# EAGLE schematic Wideband AFR (EAGLE 9.6.2)
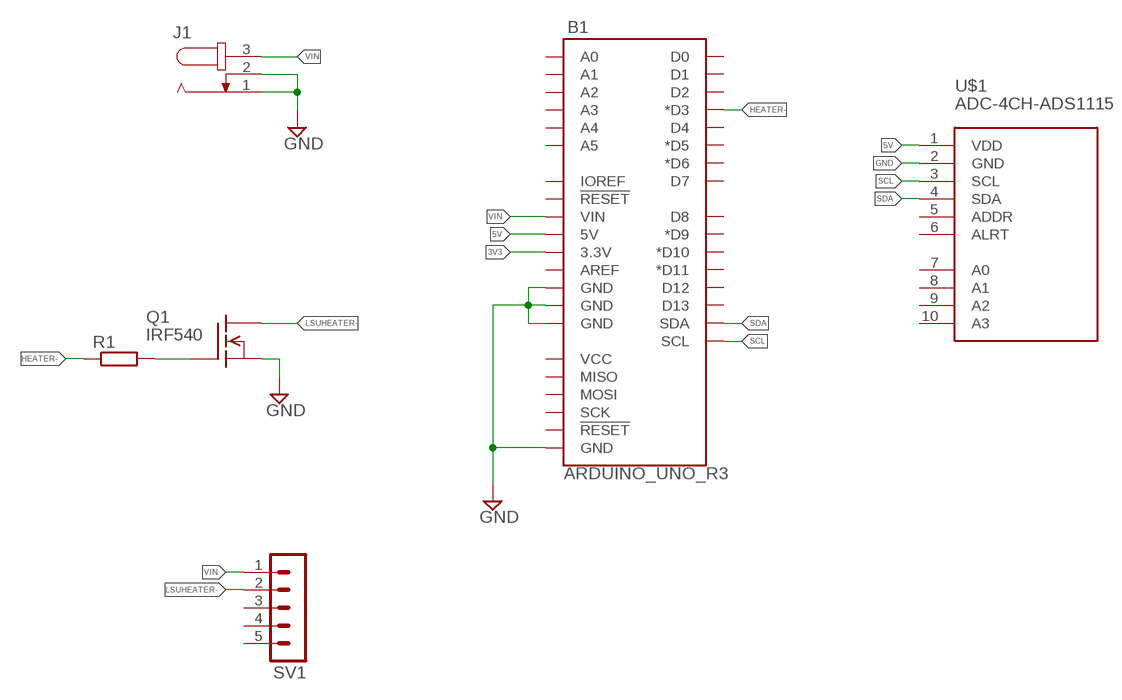
[diagram p0: schematic, sheet 1]

## Parts
B1  ARDUINO_UNO_R3  [ARDUINO_R3]
J1  JACK-PLUG1  [SPC4078]
Q1  IRF540  [TO220]
R1  R-EU_0207/10  [0207/10]
SV1  MA05-1  [MA05-1]
U$1  ADC-4CH-ADS1115  [ADC-4CH-ADS1115]

## Nets
3V3: B1.3.3V
5V: B1.5V U$1.1(VDD)
GND: B1.GND@1(GND) B1.GND@2(GND) B1.GND@3(GND) B1.GND@4(GND) Q1.3(S) U$1.2(GND)
HEATER-: B1.D3(*D3) R1.1
LSUHEATER-: Q1.2(D) SV1.2
N$1: J1.1 J1.2 ; supply symbol labelled GND
N$2: Q1.1(G) R1.2
SCL: B1.SCL U$1.3(SCL)
SDA: B1.SDA U$1.4(SDA)
VIN: B1.VIN J1.3 SV1.1
Unconnected: B1.A0 B1.A1 B1.A2 B1.A3 B1.A4 B1.A5 B1.AREF B1.D0 B1.D1 B1.D2 B1.D4 B1.D5(*D5) B1.D6(*D6) B1.D7 B1.D8 B1.D9(*D9) B1.D10(*D10) B1.D11(*D11) B1.D12 B1.D13 B1.IOREF B1.MISO B1.MOSI B1.RESET@1(!RESET!) B1.RESET@2(!RESET!) B1.SCK B1.VCC SV1.3 SV1.4 SV1.5 U$1.5(ADDR) U$1.6(ALRT) U$1.7(A0) U$1.8(A1) U$1.9(A2) U$1.10(A3)

## Library data of the parts
B1 = SparkFun-Boards:ARDUINO_UNO_R3: Arduino R3 Footprint with SPI header Arduino Uno R3 Compatible Footprint. Matches PCB size of the original board. SparkFun Products: SAMD21 Dev Breakout <https://www.sparkfun.com/products/13672> RedBoard <https://www.sparkfun.com/products/12757> R3 Stackable Headers <https://www.sparkfun.com/products/11417>
J1 = con-jack:JACK-PLUG: DC POWER JACK Power Jack, DC, Right Angle, Through Hole, Rated 5A at 16VDC, PC Terminals Distributor: Farnell (www.Farnell.de) Drawing: 84N1161.pdf / 84N1162.pdf Manufacturer: SPC Technology (www.spctechnology.com) Type: SPC4077 / SPC 4078; OC_FARNELL: unknown; OC_NEWARK: unknown
Q1 = transistor-fet:IRF540: N-Channel Enhancement MOSFET (HEXFET); 100V; 28A; 0,077Ohm
R1 = rcl:R-EU_: RESISTOR, European symbol; SPICEPREFIX: R
SV1 = con-lstb:MA05-1: PIN HEADER; OC_FARNELL: unknown; OC_NEWARK: unknown
U$1 = diy-modules:ADC-4CH-ADS1115: 4 Channel 16-Bit Analog-to-Digital Converter based on ADS1115 chip Arduino ADS1115 Getting Started Tutorial is available here: http://henrysbench.capnfatz.com/henrys-bench/arduino-voltage-measurements/arduino-ads1115-module-getting-started-tutorial/ ADS1115 datasheet is available here: http://www.ti.com/lit/ds/symlink/ads1115.pdf Click here to find device on ebay.com <http://www.ebay.com/sch/ads1115+module>